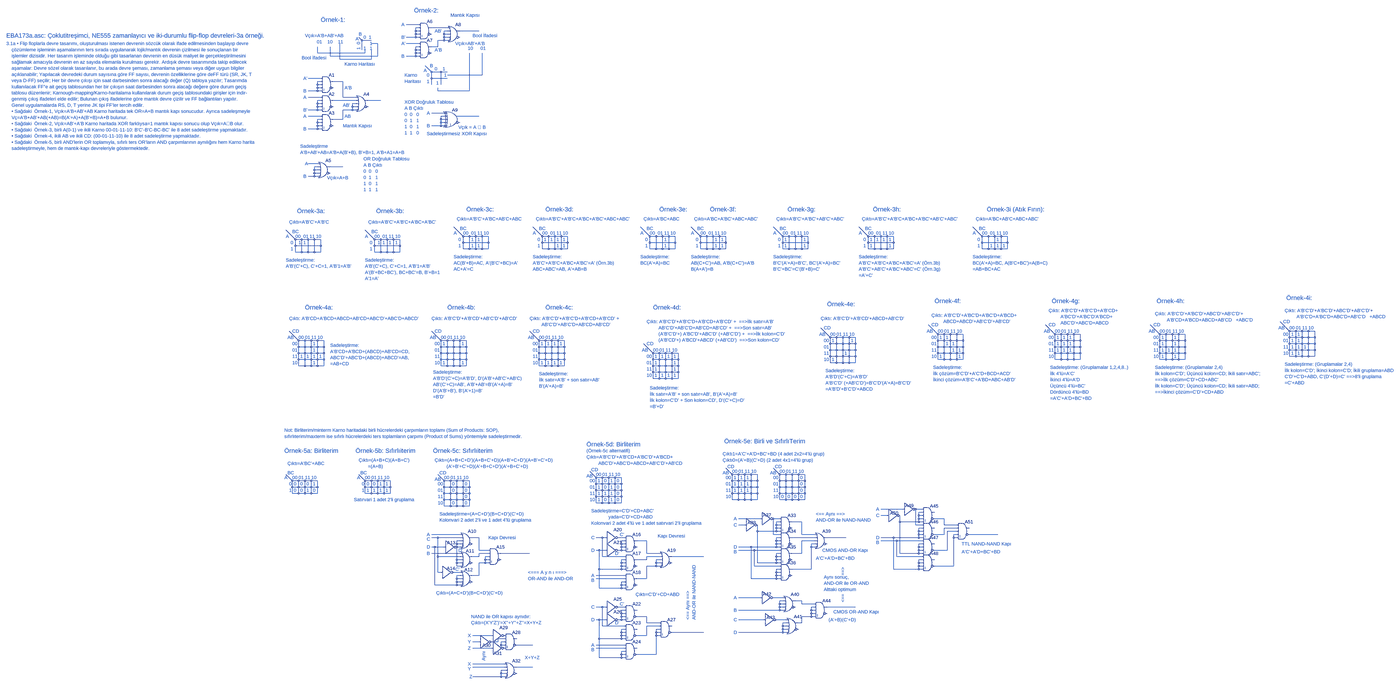
[diagram p0: schematic EBA173a.asc, whole sheet]
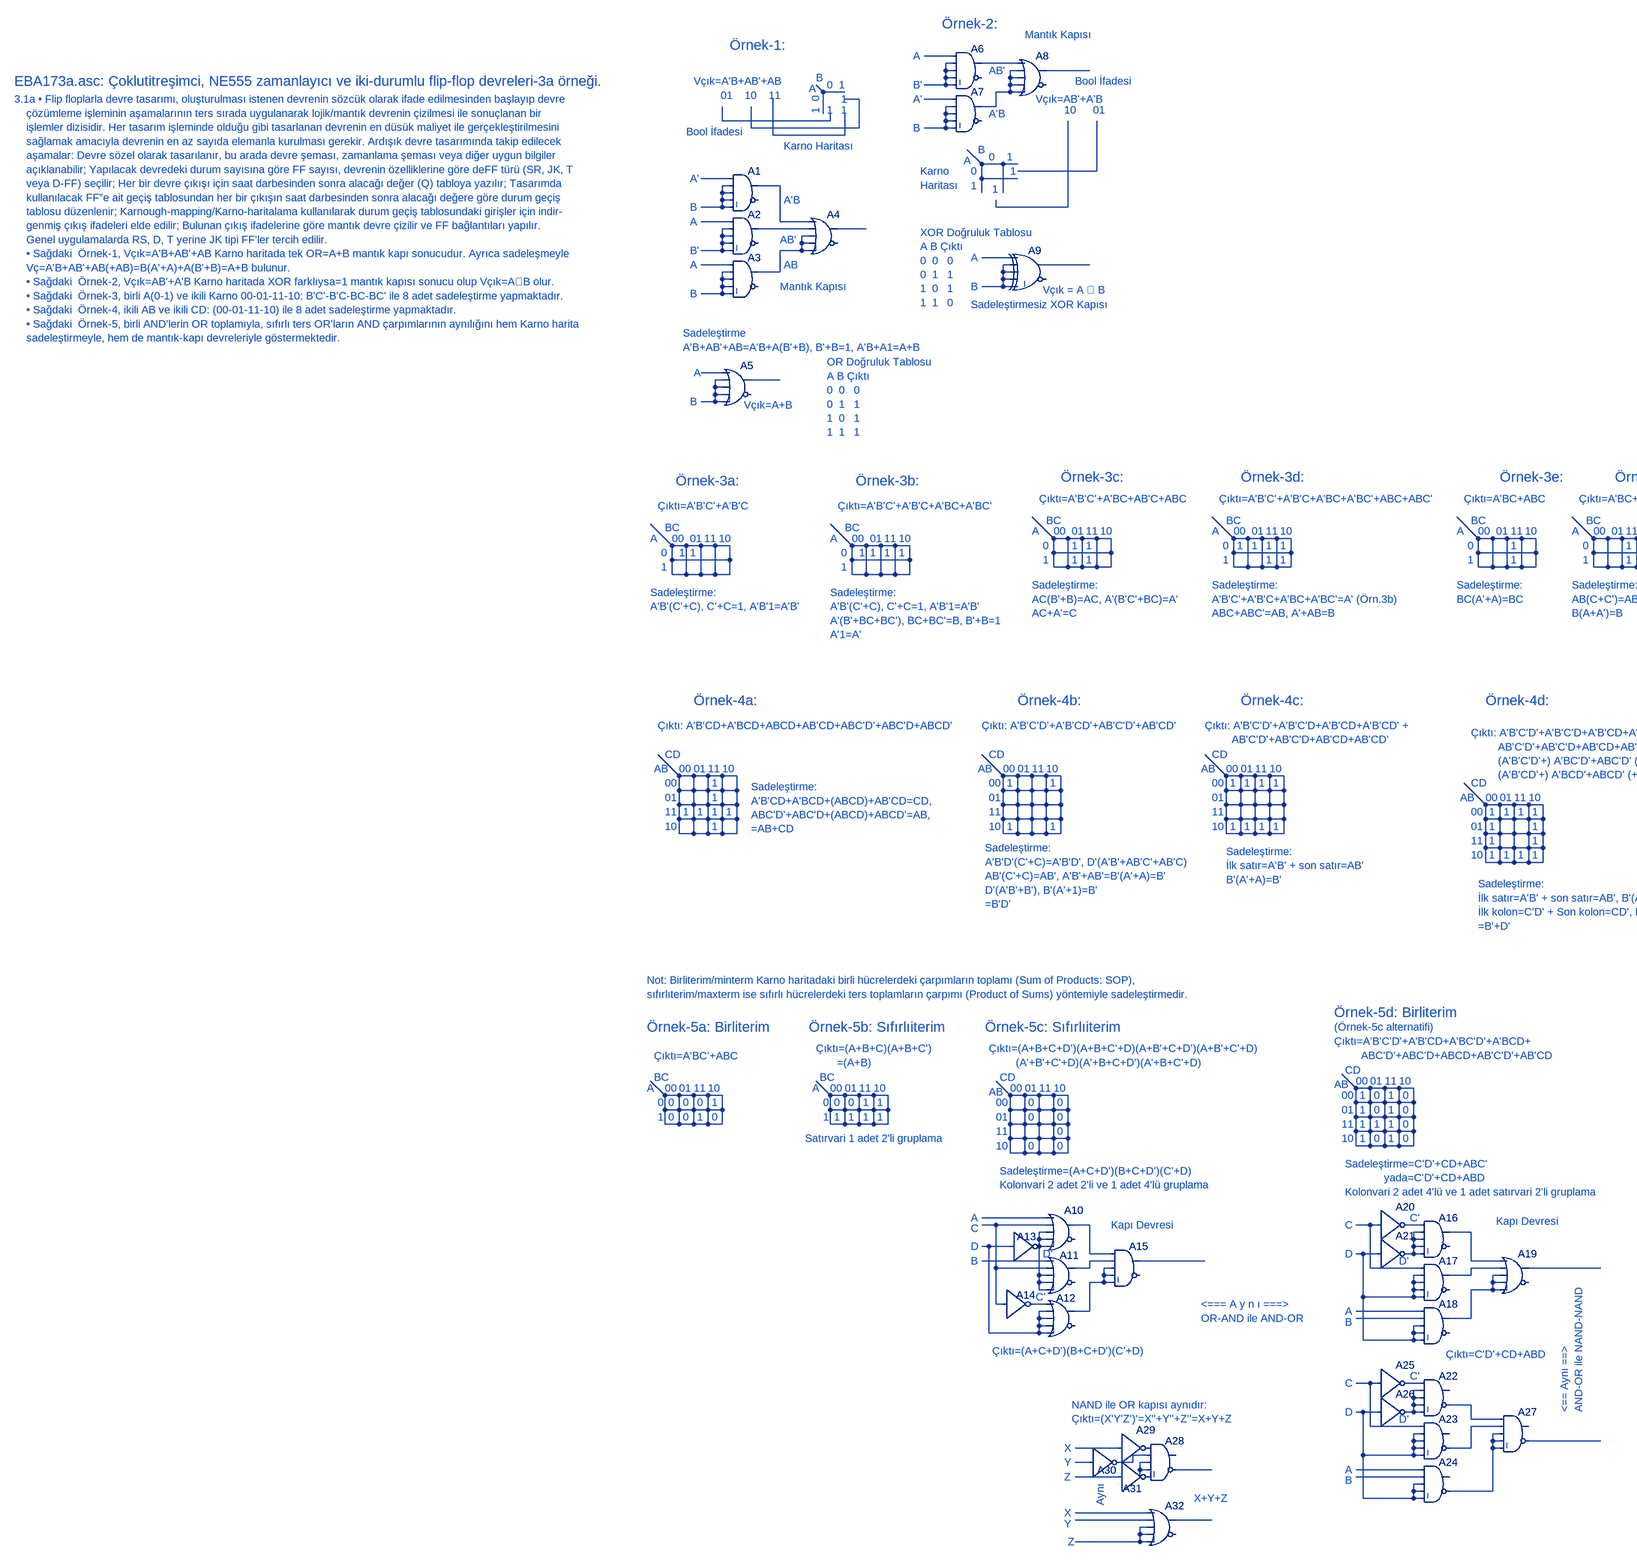
[diagram p1: schematic EBA173a.asc, part, row 1 of 1, column 1 of 2]
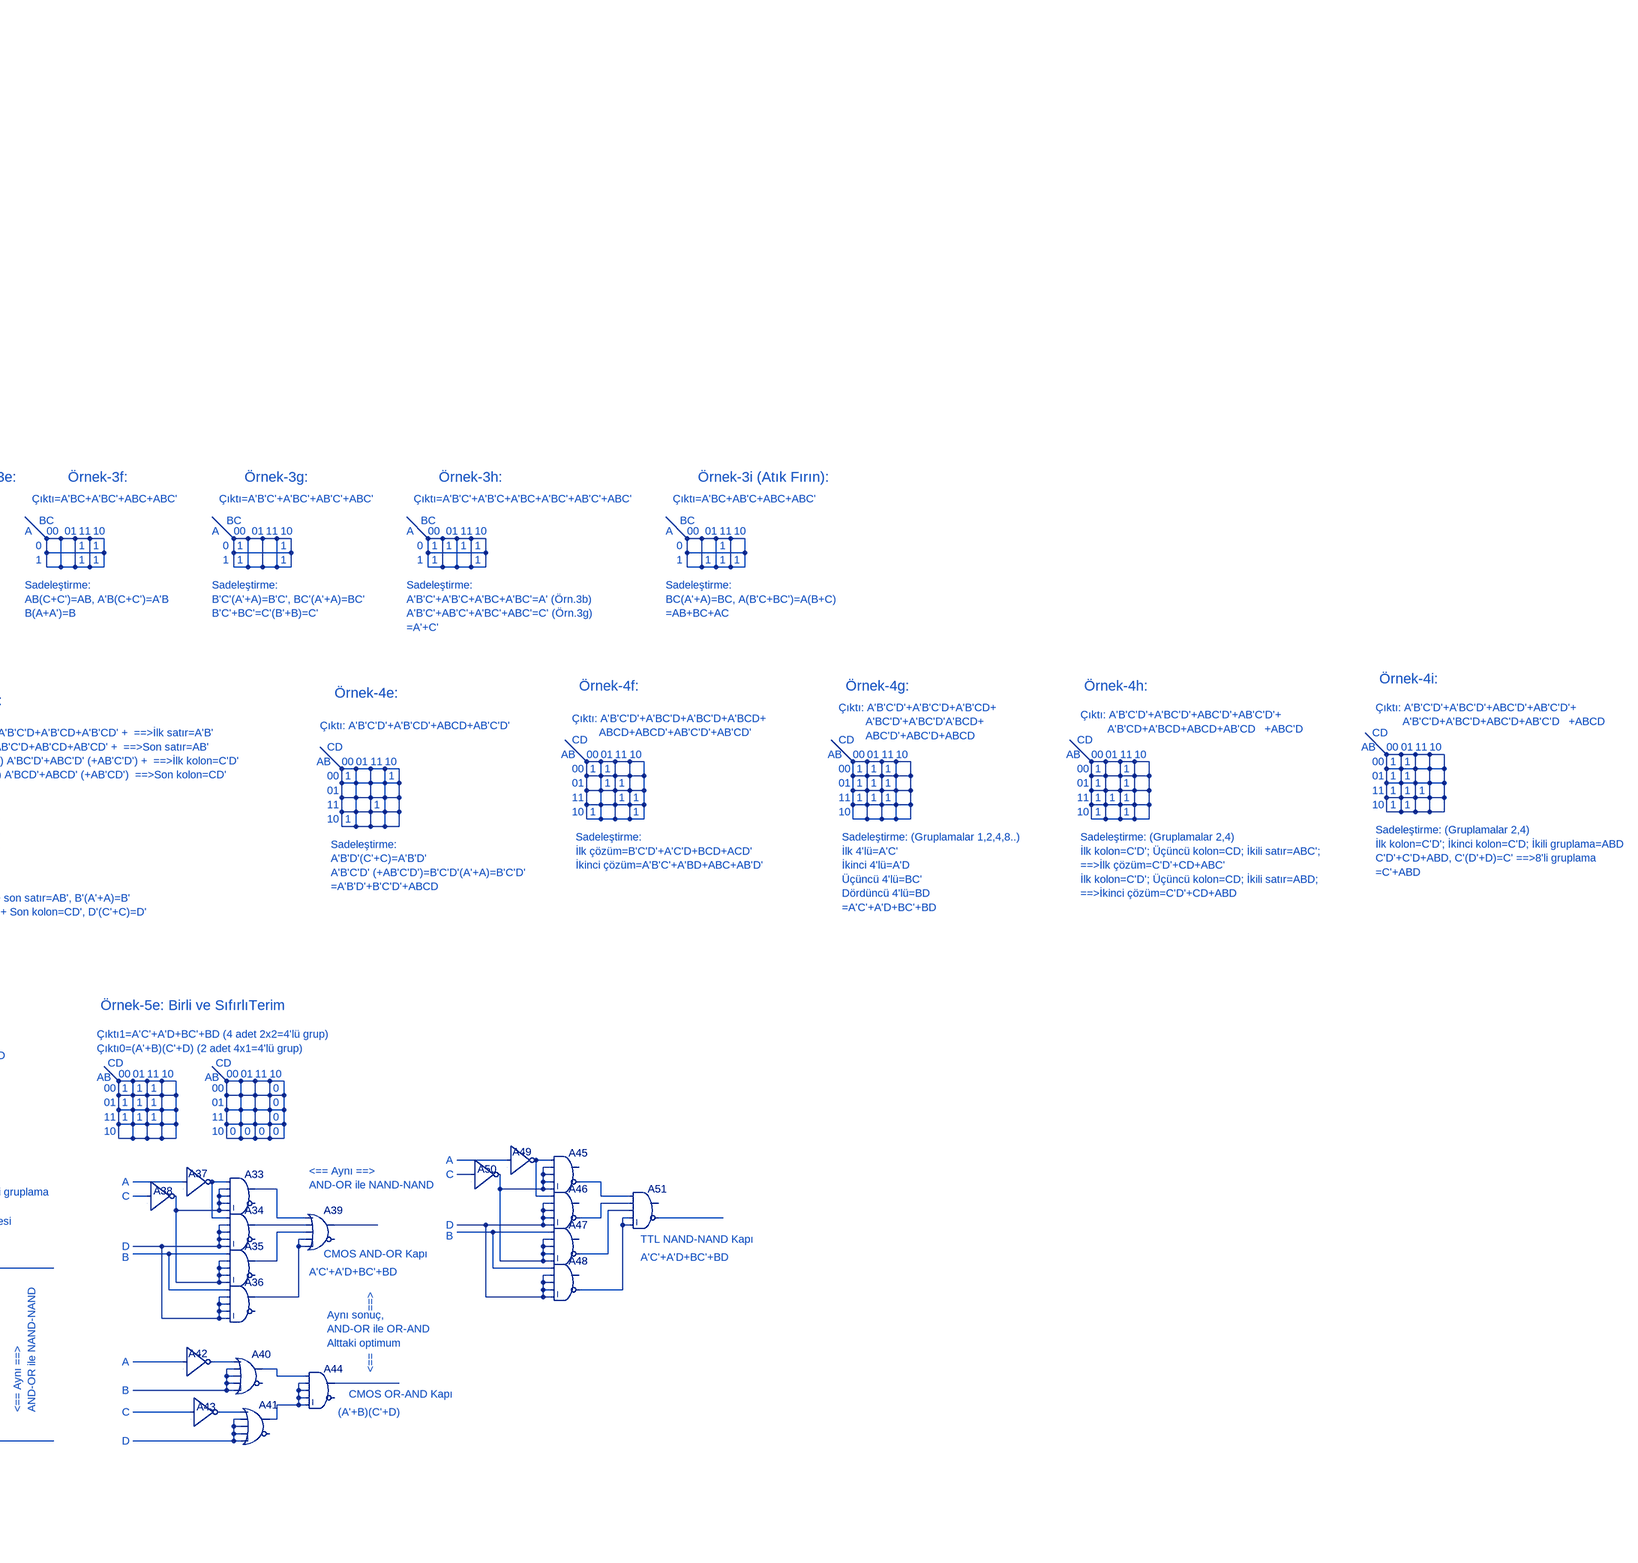
[diagram p2: schematic EBA173a.asc, part, row 1 of 1, column 2 of 2]
* EBA173a.asc
A1 N014 N015 N015 N015 N015 0 N016 0 AND
A2 N018 N019 N019 N019 N019 0 N020 0 AND
A3 N024 N027 N027 N027 N027 0 N022 0 AND
A4 N016 N020 N022 N022 N022 0 N021 0 OR
A5 N028 N029 N029 N029 N029 0 N030 0 OR
A6 N001 N002 N002 N002 N002 0 N003 0 AND
A7 N008 N009 N009 N009 N009 0 N004 0 AND
A8 N003 N004 N004 N004 N004 0 N005 0 OR
A9 N023 N025 N025 N025 N025 0 N026 0 XOR
A10 N068 N071 N078 N078 N078 0 N072 0 OR
A11 N087 N071 N078 N078 N078 0 N088 0 OR
A12 N094 N084 N084 N084 N084 0 N090 0 OR
A13 N084 0 0 0 0 N078 0 0 BUF
A14 N071 0 0 0 0 N094 0 0 BUF
A15 N072 N088 N090 N090 N090 0 N089 0 AND
A16 N074 N079 N079 N079 N079 0 N080 0 AND
A17 N073 N085 N085 N085 N085 0 N091 0 AND
A18 N095 N096 N085 N085 N085 0 N093 0 AND
A19 N080 N091 N093 N093 N093 0 N092 0 OR
A20 N073 0 0 0 0 N074 0 0 BUF
A21 N085 0 0 0 0 N079 0 0 BUF
A22 N102 N105 N105 N105 N105 N106 0 0 AND
A23 N101 N107 N107 N107 N107 N111 0 0 AND
A24 N119 N121 N107 N107 N107 N112 0 0 AND
A25 N101 0 0 0 0 N102 0 0 BUF
A26 N107 0 0 0 0 N105 0 0 BUF
A27 N106 N111 N112 N112 N112 N113 0 0 AND
A28 P001 N115 N117 N117 P002 N118 0 0 AND
A29 N114 0 0 0 0 P001 0 0 BUF
A30 N116 0 0 0 0 N115 0 0 BUF
A31 N120 0 0 0 0 P002 0 0 BUF
A32 N122 N123 N125 N125 N125 0 N124 0 OR
A33 N060 N062 N062 N062 N062 0 N063 0 AND
A34 N060 N075 N075 N075 N075 0 N076 0 AND
A35 N086 N062 N062 N062 N062 0 N081 0 AND
A36 N086 N075 N075 N075 N075 0 N083 0 AND
A37 N059 0 0 0 0 N060 0 0 BUF
A38 N064 0 0 0 0 N062 0 0 BUF
A39 N063 N076 N081 N083 N083 0 N077 0 OR
A40 N098 N099 N099 N099 N099 0 N100 0 OR
A41 N109 N110 N110 N110 N110 0 N103 0 OR
A42 N097 0 0 0 0 N098 0 0 BUF
A43 N108 0 0 0 0 N109 0 0 BUF
A44 N100 N103 N103 N103 N103 0 N104 0 AND
A45 N056 N057 N057 N057 N057 N061 0 0 AND
A46 N056 N065 N065 N065 N065 N066 0 0 AND
A47 N082 N057 N057 N057 N057 N067 0 0 AND
A48 N082 N065 N065 N065 N065 N069 0 0 AND
A49 N055 0 0 0 0 N056 0 0 BUF
A50 N058 0 0 0 0 N057 0 0 BUF
A51 N061 N066 N067 N069 N069 N070 0 0 AND
* EBA173a.asc: Çoklutitreşimci, NE555 zamanlayıcı ve iki-durumlu flip-flop devreleri-3a örneği.
* 3.1a • Flip floplarla devre tasarımı, oluşturulması istenen devrenin sözcük olarak ifade edilmesinden başlayıp devre
*     çözümleme işleminin aşamalarının ters sırada uygulanarak lojik/mantık devrenin çizilmesi ile sonuçlanan bir
*     işlemler dizisidir. Her tasarım işleminde olduğu gibi tasarlanan devrenin en düsük maliyet ile gerçekleştirilmesini
*     sağlamak amacıyla devrenin en az sayıda elemanla kurulması gerekir. Ardışık devre tasarımında takip edilecek
*     aşamalar: Devre sözel olarak tasarılanır, bu arada devre şeması, zamanlama şeması veya diğer uygun bilgiler
*     açıklanabilir; Yapılacak devredeki durum sayısına göre FF sayısı, devrenin özelliklerine göre deFF türü (SR, JK, T
*     veya D-FF) seçilir; Her bir devre çıkışı için saat darbesinden sonra alacağı değer (Q) tabloya yazılır; Tasarımda
*     kullanılacak FF‟e ait geçiş tablosundan her bir çıkışın saat darbesinden sonra alacağı değere göre durum geçiş
*     tablosu düzenlenir; Karnough-mapping/Karno-haritalama kullanılarak durum geçiş tablosundaki girişler için indir-
*     genmiş çıkış ifadeleri elde edilir; Bulunan çıkış ifadelerine göre mantık devre çizilir ve FF bağlantıları yapılır.
*     Genel uygulamalarda RS, D, T yerine JK tipi FF'ler tercih edilir.
*     • Sağdaki  Örnek-1, Vçık=A'B+AB'+AB Karno haritada tek OR=A+B mantık kapı sonucudur. Ayrıca sadeleşmeyle
*     Vç=A'B+AB'+AB(+AB)=B(A'+A)+A(B'+B)=A+B bulunur.
*     • Sağdaki  Örnek-2, Vçık=AB'+A'B Karno haritada XOR farklıysa=1 mantık kapısı sonucu olup Vçık=A⊕B olur.
*     • Sağdaki  Örnek-3, birli A(0-1) ve ikili Karno 00-01-11-10: B'C'-B'C-BC-BC' ile 8 adet sadeleştirme yapmaktadır.
*     • Sağdaki  Örnek-4, ikili AB ve ikili CD: (00-01-11-10) ile 8 adet sadeleştirme yapmaktadır.
*     • Sağdaki  Örnek-5, birli AND'lerin OR toplamıyla, sıfırlı ters OR'ların AND çarpımlarının aynılığını hem Karno harita
*     sadeleştirmeyle, hem de mantık-kapı devreleriyle göstermektedir.
* A'
* B
* A
* B'
* A
* B
* A'B
* AB'
* AB
* Vçık=A'B+AB'+AB
*          01    10    11
* A
* B
* 0  1
* 1  0
* 1
* 1
* 1
* Sadeleştirme
* A'B+AB'+AB=A'B+A(B'+B), B'+B=1, A'B+A1=A+B
* A
* B
* Vçık=A+B
* Karno Haritası
* Mantık Kapısı
* Bool İfadesi
* Örnek-1:
* Örnek-2:
* A
* B'
* A'
* B
* AB'
* A'B
* Vçık=AB'+A'B
* 10
* 01
* A
* B
* 0
* 1
* 0
* 1
* 1
* 1
* Mantık Kapısı
* Bool İfadesi
* Karno
* Haritası
* XOR Doğruluk Tablosu
* A B Çıktı
* 0  0   0
* 0  1   1
* 1  0   1
* 1  1   0
* A
* B
* Vçık = A ⊕ B
* Sadeleştirmesiz XOR Kapısı
* 0
* 1
* 00
* 01
* 11
* 10
* A
* BC
* 1
* 1
* Çıktı=A'B'C'+A'B'C
* Sadeleştirme:
* A'B'(C'+C), C'+C=1, A'B'1=A'B'
* Örnek-3a:
* 0
* 1
* 00
* 01
* 11
* 10
* A
* BC
* 1
* 1
* Çıktı=A'B'C'+A'B'C+A'BC+A'BC'
* Sadeleştirme:
* A'B'(C'+C), C'+C=1, A'B'1=A'B'
* A'(B'+BC+BC'), BC+BC'=B, B'+B=1
* A'1=A'
* Örnek-3b:
* 1
* 1
* 0
* 1
* 00
* 01
* 11
* 10
* A
* BC
* 1
* Çıktı=A'B'C'+A'BC+AB'C+ABC
* Sadeleştirme:
* AC(B'+B)=AC, A'(B'C'+BC)=A'
* AC+A'=C
* 1
* Örnek-3c:
* 1
* 1
* 0
* 1
* 00
* 01
* 11
* 10
* A
* BC
* 1
* Çıktı=A'B'C'+A'B'C+A'BC+A'BC'+ABC+ABC'
* Sadeleştirme:
* A'B'C'+A'B'C+A'BC+A'BC'=A' (Örn.3b)
* ABC+ABC'=AB, A'+AB=B
* 1
* Örnek-3d:
* 1
* 1
* 1
* 1
* 0
* 1
* 00
* 01
* 11
* 10
* A
* BC
* Çıktı=A'BC+ABC
* Sadeleştirme:
* BC(A'+A)=BC
* 1
* 1
* Örnek-3e:
* 0
* 1
* 00
* 01
* 11
* 10
* A
* BC
* Çıktı=A'BC+A'BC'+ABC+ABC'
* Sadeleştirme:
* AB(C+C')=AB, A'B(C+C')=A'B
* B(A+A')=B
* 1
* 1
* Örnek-3f:
* 1
* 1
* 0
* 1
* 00
* 01
* 11
* 10
* A
* BC
* Çıktı=A'B'C'+A'BC'+AB'C'+ABC'
* Sadeleştirme:
* B'C'(A'+A)=B'C', BC'(A'+A)=BC'
* B'C'+BC'=C'(B'+B)=C'
* 1
* 1
* 1
* 1
* Örnek-3g:
* 0
* 1
* 00
* 01
* 11
* 10
* A
* BC
* Çıktı=A'B'C'+A'B'C+A'BC+A'BC'+AB'C'+ABC'
* Sadeleştirme:
* A'B'C'+A'B'C+A'BC+A'BC'=A' (Örn.3b)
* A'B'C'+AB'C'+A'BC'+ABC'=C' (Örn.3g)
* =A'+C'
* 1
* 1
* 1
* 1
* Örnek-3h:
* 1
* 1
* 0
* 1
* 00
* 01
* 11
* 10
* A
* BC
* Çıktı=A'BC+AB'C+ABC+ABC'
* Sadeleştirme:
* BC(A'+A)=BC, A(B'C+BC')=A(B+C)
* =AB+BC+AC
* 1
* Örnek-3i (Atık Fırın):
* 1
* 1
* 1
* Örnek-4a:
* 00
* 01
* 11
* 10
* CD
* 00
* 01
* 11
* 10
* AB
* 1
* 1
* 1
* 1
* 1
* 1
* 1
* Çıktı: A'B'CD+A'BCD+ABCD+AB'CD+ABC'D'+ABC'D+ABCD'
* Sadeleştirme:
* A'B'CD+A'BCD+(ABCD)+AB'CD=CD,
* ABC'D'+ABC'D+(ABCD)+ABCD'=AB,
* =AB+CD
* Örnek-4b:
* 00
* 01
* 11
* 10
* CD
* 00
* 01
* 11
* 10
* AB
* Çıktı: A'B'C'D'+A'B'CD'+AB'C'D'+AB'CD'
* 1
* 1
* 1
* 1
* Sadeleştirme:
* A'B'D'(C'+C)=A'B'D', D'(A'B'+AB'C'+AB'C)
* AB'(C'+C)=AB', A'B'+AB'=B'(A'+A)=B'
* D'(A'B'+B'), B'(A'+1)=B'
* =B'D'
* Örnek-4c:
* 00
* 01
* 11
* 10
* CD
* 00
* 01
* 11
* 10
* AB
* 1
* 1
* Çıktı: A'B'C'D'+A'B'C'D+A'B'CD+A'B'CD' +
*          AB'C'D'+AB'C'D+AB'CD+AB'CD'
* 1
* 1
* 1
* 1
* 1
* 1
* Sadeleştirme:
* İlk satır=A'B' + son satır=AB'
* B'(A'+A)=B'
* Örnek-4d:
* 00
* 01
* 11
* 10
* CD
* 00
* 01
* 11
* 10
* 1
* 1
* Çıktı: A'B'C'D'+A'B'C'D+A'B'CD+A'B'CD' +  ==>İlk satır=A'B'
*          AB'C'D'+AB'C'D+AB'CD+AB'CD' +  ==>Son satır=AB'
*          (A'B'C'D'+) A'BC'D'+ABC'D' (+AB'C'D') +  ==>İlk kolon=C'D'
*          (A'B'CD'+) A'BCD'+ABCD' (+AB'CD')  ==>Son kolon=CD'
* 1
* 1
* 1
* 1
* 1
* 1
* Sadeleştirme:
* İlk satır=A'B' + son satır=AB', B'(A'+A)=B'
* İlk kolon=C'D' + Son kolon=CD', D'(C'+C)=D'
* =B'+D'
* 1
* 1
* 1
* 1
* Örnek-4e:
* 00
* 01
* 11
* 10
* CD
* 00
* 01
* 11
* 10
* Çıktı: A'B'C'D'+A'B'CD'+ABCD+AB'C'D'
* 1
* 1
* 1
* Sadeleştirme:
* A'B'D'(C'+C)=A'B'D'
* A'B'C'D' (+AB'C'D')=B'C'D'(A'+A)=B'C'D'
* =A'B'D'+B'C'D'+ABCD
* 1
* AB
* AB
* Örnek-4f:
* 00
* 01
* 11
* 10
* CD
* 00
* 01
* 11
* 10
* Çıktı: A'B'C'D'+A'BC'D+A'BC'D+A'BCD+
*          ABCD+ABCD'+AB'C'D'+AB'CD'
* 1
* 1
* Sadeleştirme:
* İlk çözüm=B'C'D'+A'C'D+BCD+ACD'
* İkinci çözüm=A'B'C'+A'BD+ABC+AB'D'
* 1
* AB
* 1
* 1
* 1
* 1
* 1
* Örnek-4g:
* 00
* 01
* 11
* 10
* CD
* 00
* 01
* 11
* 10
* Çıktı: A'B'C'D'+A'B'C'D+A'B'CD+
*          A'BC'D'+A'BC'D'A'BCD+
*          ABC'D'+ABC'D+ABCD
* 1
* Sadeleştirme: (Gruplamalar 1,2,4,8..)
* İlk 4'lü=A'C'
* İkinci 4'lü=A'D
* Üçüncü 4'lü=BC'
* Dördüncü 4'lü=BD
* =A'C'+A'D+BC'+BD
* 1
* AB
* 1
* 1
* 1
* 1
* 1
* 1
* 1
* Örnek-4h:
* 00
* 01
* 11
* 10
* CD
* 00
* 01
* 11
* 10
* Çıktı: A'B'C'D'+A'BC'D'+ABC'D'+AB'C'D'+
*          A'B'CD+A'BCD+ABCD+AB'CD   +ABC'D
* 1
* Sadeleştirme: (Gruplamalar 2,4)
* İlk kolon=C'D'; Üçüncü kolon=CD; İkili satır=ABC';
* ==>İlk çözüm=C'D'+CD+ABC'
* İlk kolon=C'D'; Üçüncü kolon=CD; İkili satır=ABD;
* ==>İkinci çözüm=C'D'+CD+ABD
* 1
* AB
* 1
* 1
* 1
* 1
* 1
* 1
* 1
* Örnek-4i:
* 00
* 01
* 11
* 10
* CD
* 00
* 01
* 11
* 10
* Çıktı: A'B'C'D'+A'BC'D'+ABC'D'+AB'C'D'+
*          A'B'C'D+A'BC'D+ABC'D+AB'C'D   +ABCD
* 1
* Sadeleştirme: (Gruplamalar 2,4)
* İlk kolon=C'D'; İkinci kolon=C'D; İkili gruplama=ABD
* C'D'+C'D+ABD, C'(D'+D)=C' ==>8'li gruplama
* =C'+ABD
* 1
* AB
* 1
* 1
* 1
* 1
* 1
* 1
* 1
* Not: Birliterim/minterm Karno haritadaki birli hücrelerdeki çarpımların toplamı (Sum of Products: SOP),
* sıfırlıterim/maxterm ise sıfırlı hücrelerdeki ters toplamların çarpımı (Product of Sums) yöntemiyle sadeleştirmedir.
* Örnek-5a: Birliterim
* Çıktı=A'BC'+ABC
* 1
* 0
* 1
* 0
* 0
* 0
* 0
* 0
* 0
* 1
* 00
* 01
* 11
* 10
* A
* BC
* Örnek-5b: Sıfırlıiterim
* Çıktı=(A+B+C)(A+B+C')
*        =(A+B)
* 1
* 0
* 1
* 0
* 1
* 1
* 1
* 1
* 0
* 1
* 00
* 01
* 11
* 10
* A
* BC
* Örnek-5c: Sıfırlıiterim
* Çıktı=(A+B+C+D')(A+B+C'+D)(A+B'+C+D')(A+B'+C'+D)
*          (A'+B'+C'+D)(A'+B+C+D')(A'+B+C'+D)
* 0
* 01
* 00
* 01
* 11
* 10
* AB
* CD
* 00
* 11
* 10
* 0
* 0
* 0
* 0
* 0
* 0
* Sadeleştirme=(A+C+D')(B+C+D')(C'+D)
* Kolonvari 2 adet 2'li ve 1 adet 4'lü gruplama
* Örnek-5d: Birliterim
* Çıktı=A'B'C'D'+A'B'CD+A'BC'D'+A'BCD+
*          ABC'D'+ABC'D+ABCD+AB'C'D'+AB'CD
* 0
* 01
* 00
* 01
* 11
* 10
* AB
* CD
* 00
* 11
* 10
* 0
* 0
* 0
* 0
* 0
* 0
* Sadeleştirme=C'D'+CD+ABC'
*              yada=C'D'+CD+ABD
* Kolonvari 2 adet 4'lü ve 1 adet satırvari 2'li gruplama
* (Örnek-5c alternatifi)
* 1
* 1
* 1
* 1
* 1
* 1
* 1
* 1
* 1
* A
* C
* D
* D'
* B
* C'
* Çıktı=(A+C+D')(B+C+D')(C'+D)
* Kapı Devresi
* C
* D
* C'
* D'
* A
* B
* Çıktı=C'D'+CD+ABD
* Kapı Devresi
* <=== A y n ı ===>
* OR-AND ile AND-OR
* C
* D
* C'
* D'
* A
* B
* NAND ile OR kapısı aynıdır:
* Çıktı=(X'Y'Z')'=X''+Y''+Z''=X+Y+Z
* X
* Y
* Z
* X+Y+Z
* X
* Y
* Z
* Aynı
* <== Aynı ==>
* AND-OR ile NAND-NAND
* Örnek-5e: Birli ve SıfırlıTerim
* Çıktı1=A'C'+A'D+BC'+BD (4 adet 2x2=4'lü grup)
* Çıktı0=(A'+B)(C'+D) (2 adet 4x1=4'lü grup)
* 01
* 00
* 01
* 11
* 10
* AB
* CD
* 00
* 11
* 10
* 1
* 1
* 1
* 1
* 1
* 1
* 1
* 01
* 00
* 01
* 11
* 10
* AB
* CD
* 00
* 11
* 10
* 0
* 0
* 0
* 0
* 0
* 1
* 1
* 0
* 0
* A
* C
* D
* B
* A'C'+A'D+BC'+BD
* A
* B
* C
* D
* (A'+B)(C'+D)
* Aynı sonuç,
* AND-OR ile OR-AND
* Alttaki optimum
* <==
* ==>
* CMOS OR-AND Kapı
* CMOS AND-OR Kapı
* A
* C
* D
* B
* A'C'+A'D+BC'+BD
* TTL NAND-NAND Kapı
* OR Doğruluk Tablosu
* A B Çıktı
* 0  0   0
* 0  1   1
* 1  0   1
* 1  1   1
* Satırvari 1 adet 2'li gruplama
* <== Aynı ==>
* AND-OR ile NAND-NAND
.backanno
.end